# Altium project IPG.PrjPcb (part 13 of 13)
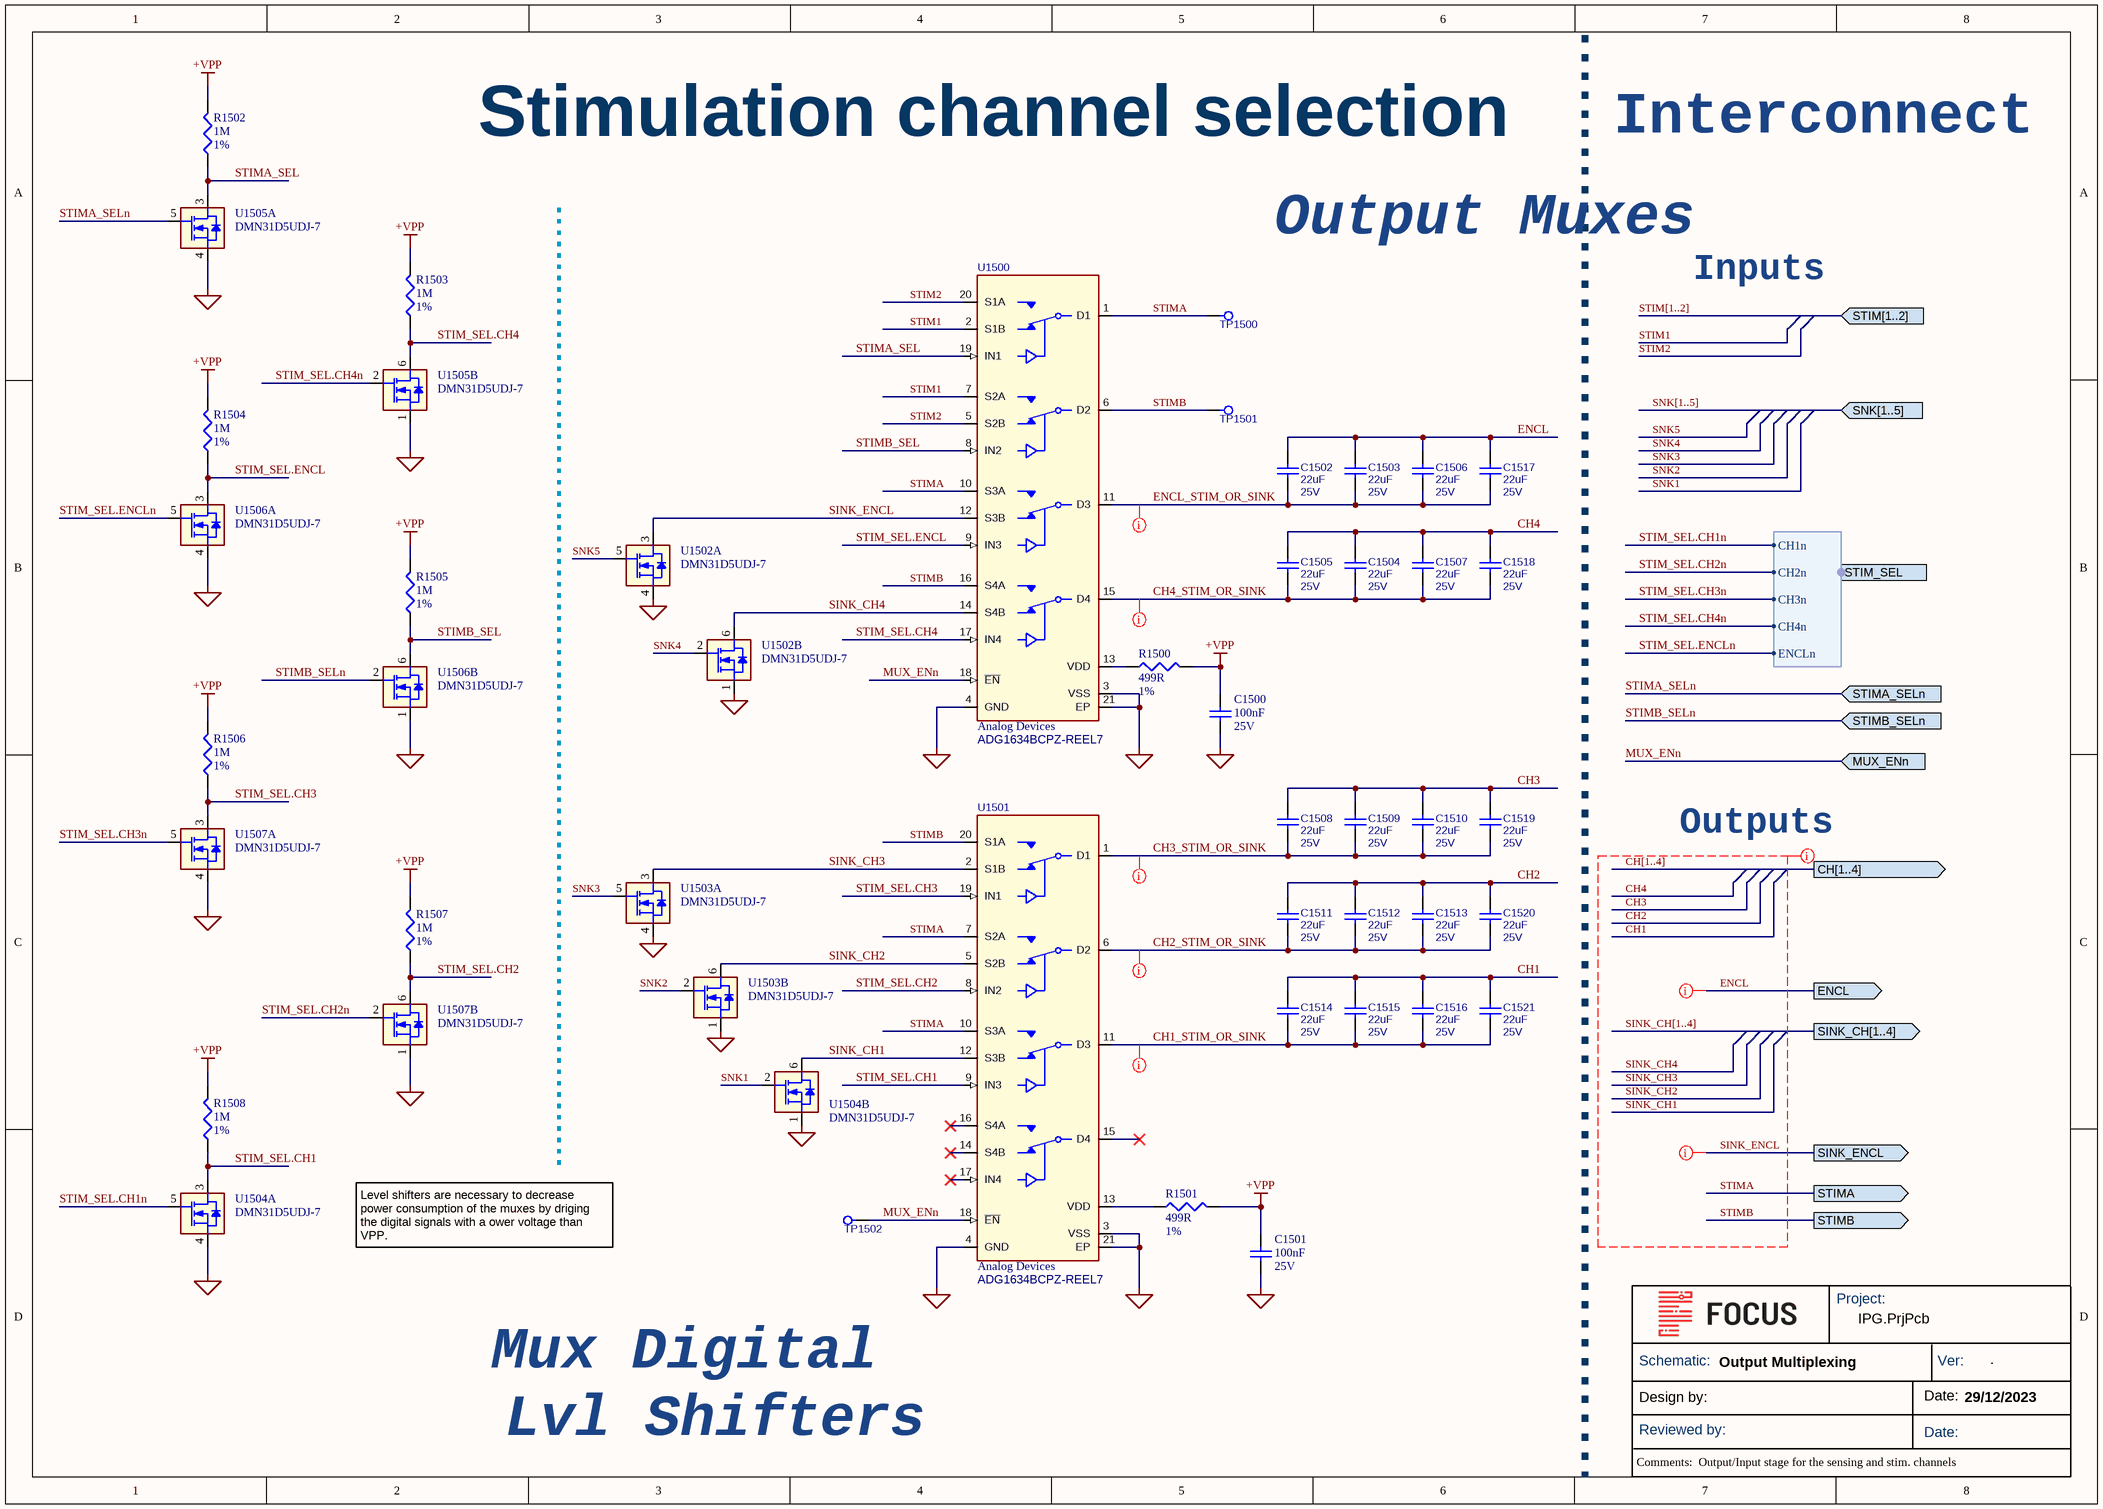
[diagram p131: 15-StimChannelSelection.SchDoc]

## Nets that join several sheets
+DVDD: 04-BLE (M400.2 R400.1), 08-MagnetSensor (M801.2), 03-MCU (25 pins), 07-PowerManagement (5 pins), 05-WPT (R513.1 R514.1), 13-Digital (5 pins)
+VBAT1F: 06-BatteryManagement (8 pins), 08-MagnetSensor (D800.2)
+VBAT1R: 06-BatteryManagement (5 pins), 14-TestFixture (J1401.2)
+VBAT1SW: 06-BatteryManagement (R625.1 TP605.1 U606.3 U616.4), 07-PowerManagement (R712.2 U709.A1)
+VBAT2F: 06-BatteryManagement (8 pins), 08-MagnetSensor (D801.2)
+VBAT2R: 06-BatteryManagement (5 pins), 14-TestFixture (J1401.3)
+VBAT2SW: 06-BatteryManagement (R628.1 TP622.1 U606.6 U616.1), 07-PowerManagement (R713.2 U710.A1)
+VCHG_RAIL: 06-BatteryManagement (8 pins), 07-PowerManagement (D703.2), 05-WPT (7 pins)
+VDDA: 07-PowerManagement (C711.2 TP711.1 U704.1), 10-Sensing (28 pins)
+VDDS: 09-IMC (R903.1 U905.4), 07-PowerManagement (C708.2 TP709.1 U702.1), 11-Stimulation (16 pins)
+VPP: 09-IMC (R915.1 U906.4), 07-PowerManagement (TP705.1 U708.3), 11-Stimulation (6 pins), 15-StimChannelSelection (11 pins)
GND: 06-BatteryManagement (51 pins), 04-BLE (28 pins), 12-Electrodes (C1200.1 C1215.1), 09-IMC (16 pins), 08-MagnetSensor (7 pins), 03-MCU (35 pins), 07-PowerManagement (37 pins), 10-Sensing (26 pins), 11-Stimulation (21 pins), 05-WPT (41 pins), 13-Digital (9 pins), 14-TestFixture (29 pins), 15-StimChannelSelection (20 pins)
ACC.SCL: 03-MCU (U301.F10), 13-Digital (J1300.1 R1300.2 R1302.1 U1301.3)
ACC.SDA: 03-MCU (U301.F12), 13-Digital (J1300.2 R1301.2 R1303.1 U1301.6)
ACC_EN: 03-MCU (U301.C7), 13-Digital (TP1300.1 U1300.6)
AMPL_RSTn: 03-MCU (U301.A2), 11-Stimulation (TP1112.1 U1100.3)
BATT.MON1: 06-BatteryManagement (TP633.1 U604.A1 U604.C2), 03-MCU (U301.J2)
BATT.MON2: 06-BatteryManagement (TP634.1 U605.A1 U605.C2), 03-MCU (U301.G4)
BATT.MON_EN: 06-BatteryManagement (6 pins), 03-MCU (U301.K2)
BATT.SW_EN: 06-BatteryManagement (D604.2 TP631.1), 03-MCU (U301.A11)
BATT_SW: 06-BatteryManagement (R623.2 R624.2 TP632.1 U607.2), 08-MagnetSensor (C800.1 U801.6 U802.3 U802.6)
BLE_P.1: 04-BLE (TP404.1 U400.F3), 03-MCU (U301.A6)
BLE_P.2: 04-BLE (TP405.1 U400.G4), 03-MCU (U301.G9)
BLE_PWRn: 04-BLE (M400.1 R400.2 TP406.1), 03-MCU (U301.C12)
BLE_RSTn: 04-BLE (J400.10 TP403.1 U400.F2), 03-MCU (U301.F9)
BLE_UART.RX: 04-BLE (U400.E2), 14-TestFixture (JP1403.1 TP1405.1)
BLE_UART.TX: 04-BLE (U400.G2), 14-TestFixture (JP1401.1 TP1406.1)
CB_EN: 03-MCU (U301.B7), 13-Digital (Q1300.1 TP1301.1 U1301.2 U1301.5)
CHG1.EN: 06-BatteryManagement (R603.1 TP602.1 U608.2 U613.5), 03-MCU (U301.J7)
CHG1.OVP_ERRn: 06-BatteryManagement (R603.2 TP606.1 U613.6), 03-MCU (U301.J8)
CHG1.STATUS: 06-BatteryManagement (U600.2), 03-MCU (U301.K8)
CHG2.EN: 06-BatteryManagement (R616.1 TP623.1 U609.2 U615.5), 03-MCU (U301.L7)
CHG2.OVP_ERRn: 06-BatteryManagement (R616.2 TP626.1 U615.6), 03-MCU (U301.M8)
CHG2.STATUS: 06-BatteryManagement (U602.2), 03-MCU (U301.L8)
CHG_RATE1: 06-BatteryManagement (TP629.1 U610.5 U611.5), 03-MCU (U301.J6)
CHG_RATE2: 06-BatteryManagement (TP630.1 U610.2 U611.2), 03-MCU (U301.M7)
DEBUG_UART_RX: 03-MCU (TP302.1 U301.D11), 14-TestFixture (JP1402.1)
DEBUG_UART_TX: 03-MCU (TP303.1 U301.D10), 14-TestFixture (JP1400.1)
ECG.HR_LOD: 03-MCU (U301.C3), 10-Sensing (TP1009.1 U1001.C1)
ECG.HR_OUT: 03-MCU (U301.M4), 10-Sensing (C1012.1 R1029.2 TP1010.1 U1001.D1)
ECG.HR_SDNn: 03-MCU (U301.D6), 10-Sensing (TP1001.1 U1001.B1)
ECG.RLD: 03-MCU (U301.B6), 10-Sensing (TP1005.1 U1001.C2 U1003.C2)
ECG.RR_LOD: 03-MCU (U301.A10), 10-Sensing (TP1008.1 U1003.C1)
ECG.RR_OUT: 03-MCU (U301.L4), 10-Sensing (C1026.1 R1060.2 TP1012.1 U1003.D1)
ECG.RR_SDNn: 03-MCU (U301.B10), 10-Sensing (TP1004.1 U1003.B1)
ECG_HR+: 12-Electrodes (5 pins), 10-Sensing (R1012.1 R1020.1 TP1016.1)
ECG_HR-: 12-Electrodes (5 pins), 10-Sensing (R1018.1 R1019.1 TP1017.1)
ECG_RR+: 12-Electrodes (C1208.2 D1210.2 J1211.1), 10-Sensing (R1043.1 R1051.1 TP1019.1)
ECG_RR-: 12-Electrodes (C1212.2 D1214.2 J1215.1), 10-Sensing (R1047.1 R1050.1 TP1021.1)
ENCL: 12-Electrodes (20 pins), 15-StimChannelSelection (C1502.2 C1503.2 C1506.2 C1517.1)
ENG1+: 12-Electrodes (5 pins), 10-Sensing (R1011.1 R1017.1 TP1014.1)
ENG1-: 12-Electrodes (5 pins), 10-Sensing (R1015.1 R1016.1 TP1015.1)
ENG1.LOD: 03-MCU (U301.A5), 10-Sensing (TP1006.1 U1000.12)
ENG1.OUT: 03-MCU (U301.K4), 10-Sensing (C1011.2 R1030.1 TP1011.1 U1000.10)
ENG1.SDNn: 03-MCU (U301.C5), 10-Sensing (TP1000.1 U1000.13)
ENG2+: 12-Electrodes (C1209.2 D1211.2 J1212.1), 10-Sensing (R1042.1 R1049.1 TP1018.1)
ENG2-: 12-Electrodes (C1213.2 D1215.2 J1216.1), 10-Sensing (R1046.1 R1048.1 TP1020.1)
ENG2.LOD: 03-MCU (U301.K6), 10-Sensing (TP1007.1 U1002.12)
ENG2.OUT: 03-MCU (U301.M6), 10-Sensing (C1027.2 R1061.1 TP1013.1 U1002.10)
ENG2.SDNn: 03-MCU (U301.G10), 10-Sensing (TP1003.1 U1002.13)
HV_EN: 03-MCU (U301.L11), 07-PowerManagement (8 pins)
HVSW_EN: 03-MCU (U301.L9), 07-PowerManagement (R710.1 TP710.1 U706.2)
I2C2.SCL: 03-MCU (U301.K10), 07-PowerManagement (R707.2 U703.1), 11-Stimulation (U1102.6)
I2C2.SDA: 03-MCU (U301.K11), 07-PowerManagement (R708.2 U703.2), 11-Stimulation (U1102.8)
IMP_EN: 09-IMC (5 pins), 03-MCU (U301.E1)
IMP_IN+_SEL: 09-IMC (U901.8), 03-MCU (U301.D2)
IMP_IN-_SEL0: 09-IMC (U900.8), 03-MCU (U301.E2)
IMP_IN-_SEL1: 09-IMC (U900.7), 03-MCU (U301.D3)
IMP_IN-_SEL2: 09-IMC (U901.9), 03-MCU (U301.E3)
IMP_OUT+: 09-IMC (R902.2 TP900.1), 03-MCU (U301.J5)
IMP_OUT-: 09-IMC (R906.2 TP903.1), 03-MCU (U301.L6)
IPG_SHDN: 03-MCU (U301.B12), 07-PowerManagement (M701.1 R702.1 TP701.1)
MAG_DET: 08-MagnetSensor (M801.3 TP802.1), 03-MCU (U301.L1)
MUX_ENn: 03-MCU (U301.K7), 15-StimChannelSelection (TP1502.1 U1500.18 U1501.18)
PG_START: 03-MCU (U301.C2), 11-Stimulation (TP1110.1 U1100.2)
PH1_EN: 03-MCU (U301.A1), 11-Stimulation (TP1111.1 U1101.1)
PH2_EN: 03-MCU (U301.B2), 11-Stimulation (TP1113.1 U1101.6)
SINK_CH1: 09-IMC (U900.10), 15-StimChannelSelection (U1501.12 U1504.6)
SINK_CH2: 09-IMC (U900.12), 15-StimChannelSelection (U1501.5 U1503.6)
SINK_CH3: 09-IMC (U900.13), 15-StimChannelSelection (U1501.2 U1503.3)
SINK_CH4: 09-IMC (U900.9), 15-StimChannelSelection (U1500.14 U1502.6)
SINK_ENCL: 09-IMC (U901.11), 15-StimChannelSelection (U1500.12 U1502.3)
SNK1: 03-MCU (U301.B9), 15-StimChannelSelection (U1504.2)
SNK2: 03-MCU (U301.C8), 15-StimChannelSelection (U1503.2)
SNK3: 03-MCU (U301.B8), 15-StimChannelSelection (U1503.5)
SNK4: 03-MCU (U301.A8), 15-StimChannelSelection (U1502.2)
SNK5: 03-MCU (U301.A7), 15-StimChannelSelection (U1502.5)
SPI1.BLE_CSn: 04-BLE (U400.F6), 03-MCU (U301.G12)
SPI1.MISO: 04-BLE (U400.E5), 03-MCU (U300.2 U301.L2)
SPI1.MOSI: 04-BLE (U400.E6), 03-MCU (U300.5 U301.K3)
SPI1.SCK: 04-BLE (U400.D6), 03-MCU (U300.6 U301.M1)
SRC1: 03-MCU (U301.C9), 11-Stimulation (Q1102.1)
SRC2: 03-MCU (U301.A9), 11-Stimulation (Q1103.1)
STIM1: 11-Stimulation (Q1100.6), 15-StimChannelSelection (U1500.2 U1500.7)
STIM2: 11-Stimulation (Q1101.6), 15-StimChannelSelection (U1500.5 U1500.20)
STIM_EN: 03-MCU (U301.B3), 11-Stimulation (TP1108.1 U1105.B2)
STIM_SEL.CH1n: 03-MCU (U301.D7), 15-StimChannelSelection (U1504.5)
STIM_SEL.CH2n: 03-MCU (U301.L12), 15-StimChannelSelection (U1507.2)
STIM_SEL.CH3n: 03-MCU (U301.J10), 15-StimChannelSelection (U1507.5)
STIM_SEL.CH4n: 03-MCU (U301.M12), 15-StimChannelSelection (U1505.2)
STIM_SEL.ENCLn: 03-MCU (U301.J11), 15-StimChannelSelection (U1506.5)
STIMA: 09-IMC (U901.16), 15-StimChannelSelection (5 pins)
STIMA_SELn: 03-MCU (U301.J12), 15-StimChannelSelection (U1505.5)
STIMB: 09-IMC (U901.15), 15-StimChannelSelection (TP1501.1 U1500.6 U1500.16 U1501.20)
STIMB_SELn: 03-MCU (U301.H11), 15-StimChannelSelection (U1506.2)
SYS_RSTn: 03-MCU (J301.10 R300.2 U301.G2), 07-PowerManagement (TP712.1 U705.1)
TEMP_EN: 03-MCU (U301.J3), 05-WPT (9 pins)
THERM.OFST: 03-MCU (U301.H2), 05-WPT (TP512.1 U504.A1 U504.C2)
THERM.OUT: 03-MCU (U301.G3), 05-WPT (TP511.1 U503.A1 U503.C2)
THERM.REF: 03-MCU (U301.F3), 05-WPT (TP509.1 U501.A1 U501.C2)
VCHG_DISABLE: 03-MCU (U301.E12), 05-WPT (M500.1 TP515.1)
VCHG_PGOOD: 03-MCU (U301.E11), 05-WPT (R523.1 R524.2 TP514.1 U502.13)
VDDA_EN: 03-MCU (U301.K9), 07-PowerManagement (TP714.1 U704.3)
VDDS_EN: 03-MCU (U301.A4), 07-PowerManagement (TP713.1 U702.3)
VNSb_EN: 03-MCU (U301.A3), 11-Stimulation (TP1115.1 U1106.1)
VPPSW_EN: 03-MCU (U301.K12), 07-PowerManagement (TP707.1 U708.2)
VRECT.DETn: 03-MCU (U301.E10), 05-WPT (R513.2 TP505.1 U508.3)
VRECT.MON: 03-MCU (U301.M3), 05-WPT (TP504.1 U500.A1 U500.C2)
VRECT.MON_EN: 03-MCU (U301.B11), 05-WPT (C514.2 TP503.1 U500.A2 U505.2)
VRECT.OVPn: 03-MCU (U301.F11), 05-WPT (R514.2 TP506.1 U507.6)
XL_ACC: 12-Electrodes (5 pins), 13-Digital (C1301.2 R1304.2)
XL_GND: 12-Electrodes (5 pins), 13-Digital (C1301.1 R1305.2)
XL_SCL: 12-Electrodes (D1204.2 J1205.1 J1221.1 J1221.2), 13-Digital (R1302.2)
XL_SDA: 12-Electrodes (D1208.2 J1209.1 J1225.1 J1225.2), 13-Digital (R1303.2)